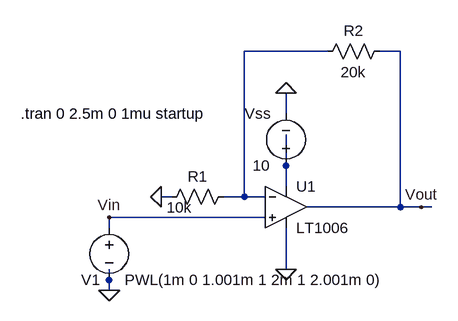
[diagram p0: schematic basic_opamp.asc]
basic_opamp.asc, the LTspice schematic file:
Version 4
SHEET 1 880 680
WIRE 384 192 256 192
WIRE 496 192 464 192
WIRE 320 288 320 256
WIRE 320 368 320 320
WIRE 320 400 320 368
WIRE 144 416 128 416
WIRE 256 416 256 192
WIRE 256 416 224 416
WIRE 288 416 256 416
WIRE 496 432 496 192
WIRE 496 432 352 432
WIRE 528 432 496 432
WIRE 544 432 528 432
WIRE 288 448 48 448
WIRE 48 464 48 448
WIRE 320 528 320 464
WIRE 48 544 48 528
WIRE 48 560 48 544
FLAG 320 528 0
FLAG 48 560 0
FLAG 528 432 Vout
FLAG 128 416 0
FLAG 48 448 Vin
FLAG 320 256 0
SYMBOL LT1006 320 368 R0
SYMATTR InstName U1
SYMBOL res 128 432 R270
WINDOW 0 32 56 VTop 2
WINDOW 3 15 28 VBottom 2
SYMATTR InstName R1
SYMATTR Value 10k
SYMBOL res 368 208 R270
WINDOW 0 32 56 VTop 2
WINDOW 3 0 56 VBottom 2
SYMATTR InstName R2
SYMATTR Value 20k
SYMBOL voltage 48 448 R0
WINDOW 0 -43 96 Left 2
SYMATTR InstName V1
SYMATTR Value PWL(1m 0 1.001m 1 2m 1 2.001m 0)
SYMBOL voltage 320 384 R180
WINDOW 0 24 96 Left 2
WINDOW 3 24 16 Left 2
SYMATTR InstName Vss
SYMATTR Value 10
TEXT -88 288 Left 2 !.tran 0 2.5m 0 1mu startup

The netlist it stands for:
* basic_opamp.asc
XU1 Vin N001 N002 0 Vout LT1006  ; pins In+ In- V+ V- OUT
R1 0 N001 10k
R2 N001 Vout 20k
V1 Vin 0 PWL(1m 0 1.001m 1 2m 1 2.001m 0)
Vss N002 0 10
.tran 0 2.5m 0 1mu startup
.lib LTC.lib
.backanno
.end